# EAGLE design placa (EAGLE 5.01)
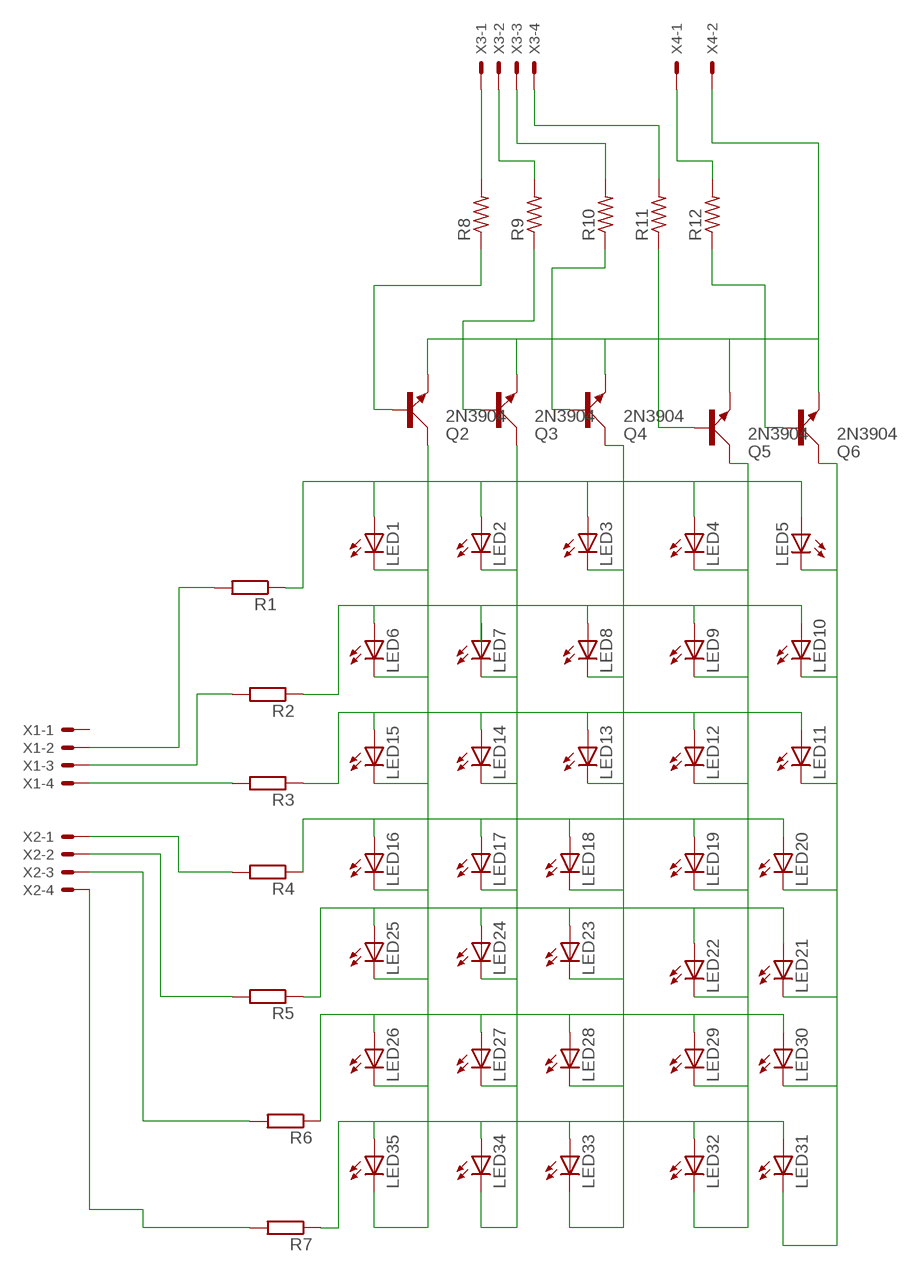
[diagram p0: schematic, sheet 1]

## Parts
LED1  LED5MM  [LED5MM]
LED2  LED5MM  [LED5MM]
LED3  LED5MM  [LED5MM]
LED4  LED5MM  [LED5MM]
LED5  LED5MM  [LED5MM]
LED6  LED5MM  [LED5MM]
LED7  LED5MM  [LED5MM]
LED8  LED5MM  [LED5MM]
LED9  LED5MM  [LED5MM]
LED10  LED5MM  [LED5MM]
LED11  LED5MM  [LED5MM]
LED12  LED5MM  [LED5MM]
LED13  LED5MM  [LED5MM]
LED14  LED5MM  [LED5MM]
LED15  LED5MM  [LED5MM]
LED16  LED5MM  [LED5MM]
LED17  LED5MM  [LED5MM]
LED18  LED5MM  [LED5MM]
LED19  LED5MM  [LED5MM]
LED20  LED5MM  [LED5MM]
LED21  LED5MM  [LED5MM]
LED22  LED5MM  [LED5MM]
LED23  LED5MM  [LED5MM]
LED24  LED5MM  [LED5MM]
LED25  LED5MM  [LED5MM]
LED26  LED5MM  [LED5MM]
LED27  LED5MM  [LED5MM]
LED28  LED5MM  [LED5MM]
LED29  LED5MM  [LED5MM]
LED30  LED5MM  [LED5MM]
LED31  LED5MM  [LED5MM]
LED32  LED5MM  [LED5MM]
LED33  LED5MM  [LED5MM]
LED34  LED5MM  [LED5MM]
LED35  LED5MM  [LED5MM]
Q2  2N3904  [TO92D]
Q3  2N3904  [TO92D]
Q4  2N3904  [TO92D]
Q5  2N3904  [TO92D]
Q6  2N3904  [TO92D]
R1  R-EU_0204/7  [0204/7]
R2  R-EU_0204/7  [0204/7]
R3  R-EU_0204/7  [0204/7]
R4  R-EU_0204/7  [0204/7]
R5  R-EU_0204/7  [0204/7]
R6  R-EU_0204/7  [0204/7]
R7  R-EU_0204/7  [0204/7]
R8  R-US_0204/7  [0204/7]
R9  R-US_0204/7  [0204/7]
R10  R-US_0204/7  [0204/7]
R11  R-US_0204/7  [0204/7]
R12  R-US_0204/7  [0204/7]
X1  KK-156-4  [KK-156-4]
X2  KK-156-4  [KK-156-4]
X3  KK-156-4  [KK-156-4]
X4  KK-156-2  [KK-156-2]

## Nets
N$1: LED1.A LED2.A LED3.A LED4.A LED5.A R1.1
N$2: LED6.A LED8.A LED9.A LED10.A R2.1
N$3: LED11.A LED12.A LED13.A LED14.A LED15.A R3.1
N$4: LED16.A LED17.A LED18.A LED19.A LED20.A R4.1
N$5: LED21.A LED22.A LED23.A LED24.A LED25.A R5.1
N$6: LED26.A LED27.A LED28.A LED29.A LED30.A R6.1
N$7: LED31.A LED32.A LED33.A LED34.A LED35.A R7.1
N$8: LED1.K(C) LED6.K(C) LED15.K(C) LED16.K(C) LED25.K(C) LED26.K(C) LED35.K(C) Q2.C
N$9: LED2.K(C) LED7.K(C) LED14.K(C) LED17.K(C) LED24.K(C) LED27.K(C) LED34.K(C) Q3.C
N$10: LED3.K(C) LED8.K(C) LED13.K(C) LED18.K(C) LED23.K(C) LED28.K(C) LED33.K(C) Q4.C
N$11: LED4.K(C) LED9.K(C) LED12.K(C) LED19.K(C) LED22.K(C) LED29.K(C) LED32.K(C) Q5.C
N$12: LED5.K(C) LED10.K(C) LED11.K(C) LED20.K(C) LED21.K(C) LED30.K(C) LED31.K(C) Q6.C
N$13: R7.2 X2.4
N$14: R6.2 X2.3
N$15: R5.2 X2.2
N$16: R4.2 X2.1
N$17: R3.2 X1.4
N$18: R2.2 X1.3
N$19: R1.2 X1.2
N$20: R8.2 X3.1
N$21: R9.2 X3.2
N$22: R10.2 X3.3
N$23: R11.2 X3.4
N$24: R12.2 X4.1
N$25: Q2.B R8.1
N$26: Q3.B R9.1
N$27: Q4.B R10.1
N$28: Q5.B R11.1
N$29: Q6.B R12.1
N$30: Q2.E Q3.E Q4.E Q5.E Q6.E X4.2
Unconnected: LED7.A X1.1

## Library data of the parts
LED1-LED35 = led:LED: LED OSRAM: - CHIPLED LG R971, LG N971, LY N971, LG Q971, LY Q971, LO R971, LY R971 LH N974, LH R974 LS Q976, LO Q976, LY Q976 LO Q996 - Hyper CHIPLED LW Q18S LB Q993, LB Q99A, LB R99A - SideLED LS A670, LO A670, LY A670, LG A670, LP A670 LB A673, LV A673, LT A673, LW A673 LH A674 LY A675 LS A676, LA A676, LO A676, LY A676, LW A676 LS A679, LY A679, LG A679 - Hyper Micro SIDELED® LS Y876, LA Y876, LO Y876, LY Y876 LT Y87S - SmartLED LW L88C, LW L88S LB L89C, LB L89S, LG L890 LS L89K, LO L89K, LY L89K LS L896, LA L896, LO L896, LY L896 - TOPLED LS T670, LO T670, LY T670, LG T670, LP T670 LSG T670, LSP T670, LSY T670, LOP T670, LYG T670 LG T671, LOG T671, LSG T671 LB T673, LV T673, LT T673, LW T673 LH T674 LS T676, LA T676, LO T676, LY T676, LB T676, LH T676, LSB T676, LW T676 LB T67C, LV T67C, LT T67C, LS T67K, LO T67K, LY T67K, LW E67C LS E67B, LA E67B, LO E67B, LY E67B, LB E67C, LV E67C, LT E67C LW T67C LS T679, LY T679, LG T679 LS T770, LO T770, LY T770, LG T770, LP T770 LB T773, LV T773, LT T773, LW T773 LH T774 LS E675, LA E675, LY E675, LS T675 LS T776, LA T776, LO T776, LY T776, LB T776 LHGB T686 LT T68C, LB T68C - Hyper Mini TOPLED® LB M676 - Mini TOPLED Santana® LG M470 LS M47K, LO M47K, LY M47K Source: http://www.osram.convergy.de - LUMILED® LXK2-PW12-R00, LXK2-PW12-S00, LXK2-PW14-U00, LXK2-PW14-V00 LXK2-PM12-R00, LXK2-PM12-S00, LXK2-PM14-U00 LXK2-PE12-Q00, LXK2-PE12-R00, LXK2-PE12-S00, LXK2-PE14-T00, LXK2-PE14-U00 LXK2-PB12-K00, LXK2-PB12-L00, LXK2-PB12-M00, LXK2-PB14-N00, LXK2-PB14-P00, LXK2-PB14-Q00 LXK2-PR12-L00, LXK2-PR12-M00, LXK2-PR14-Q00, LXK2-PR14-R00 LXK2-PD12-Q00, LXK2-PD12-R00, LXK2-PD12-S00 LXK2-PH12-R00, LXK2-PH12-S00 LXK2-PL12-P00, LXK2-PL12-Q00, LXK2-PL12-R00 Source: www.luxeon.com
Q2-Q6 = transistor-small-signal:2N3904: NPN TRANSISTOR
R1-R7 = resistor:R-EU_: RESISTOR, European symbol
R8-R12 = resistor:R-US_: RESISTOR, American symbol
X1-X3 = con-molex:KK-156-4: KK 156 HEADER Source: http://www.molex.com/pdm_docs/sd/026604100_sd.pdf
X4 = con-molex:KK-156-2: KK 156 HEADER Source: http://www.molex.com/pdm_docs/sd/026604100_sd.pdf

## Board
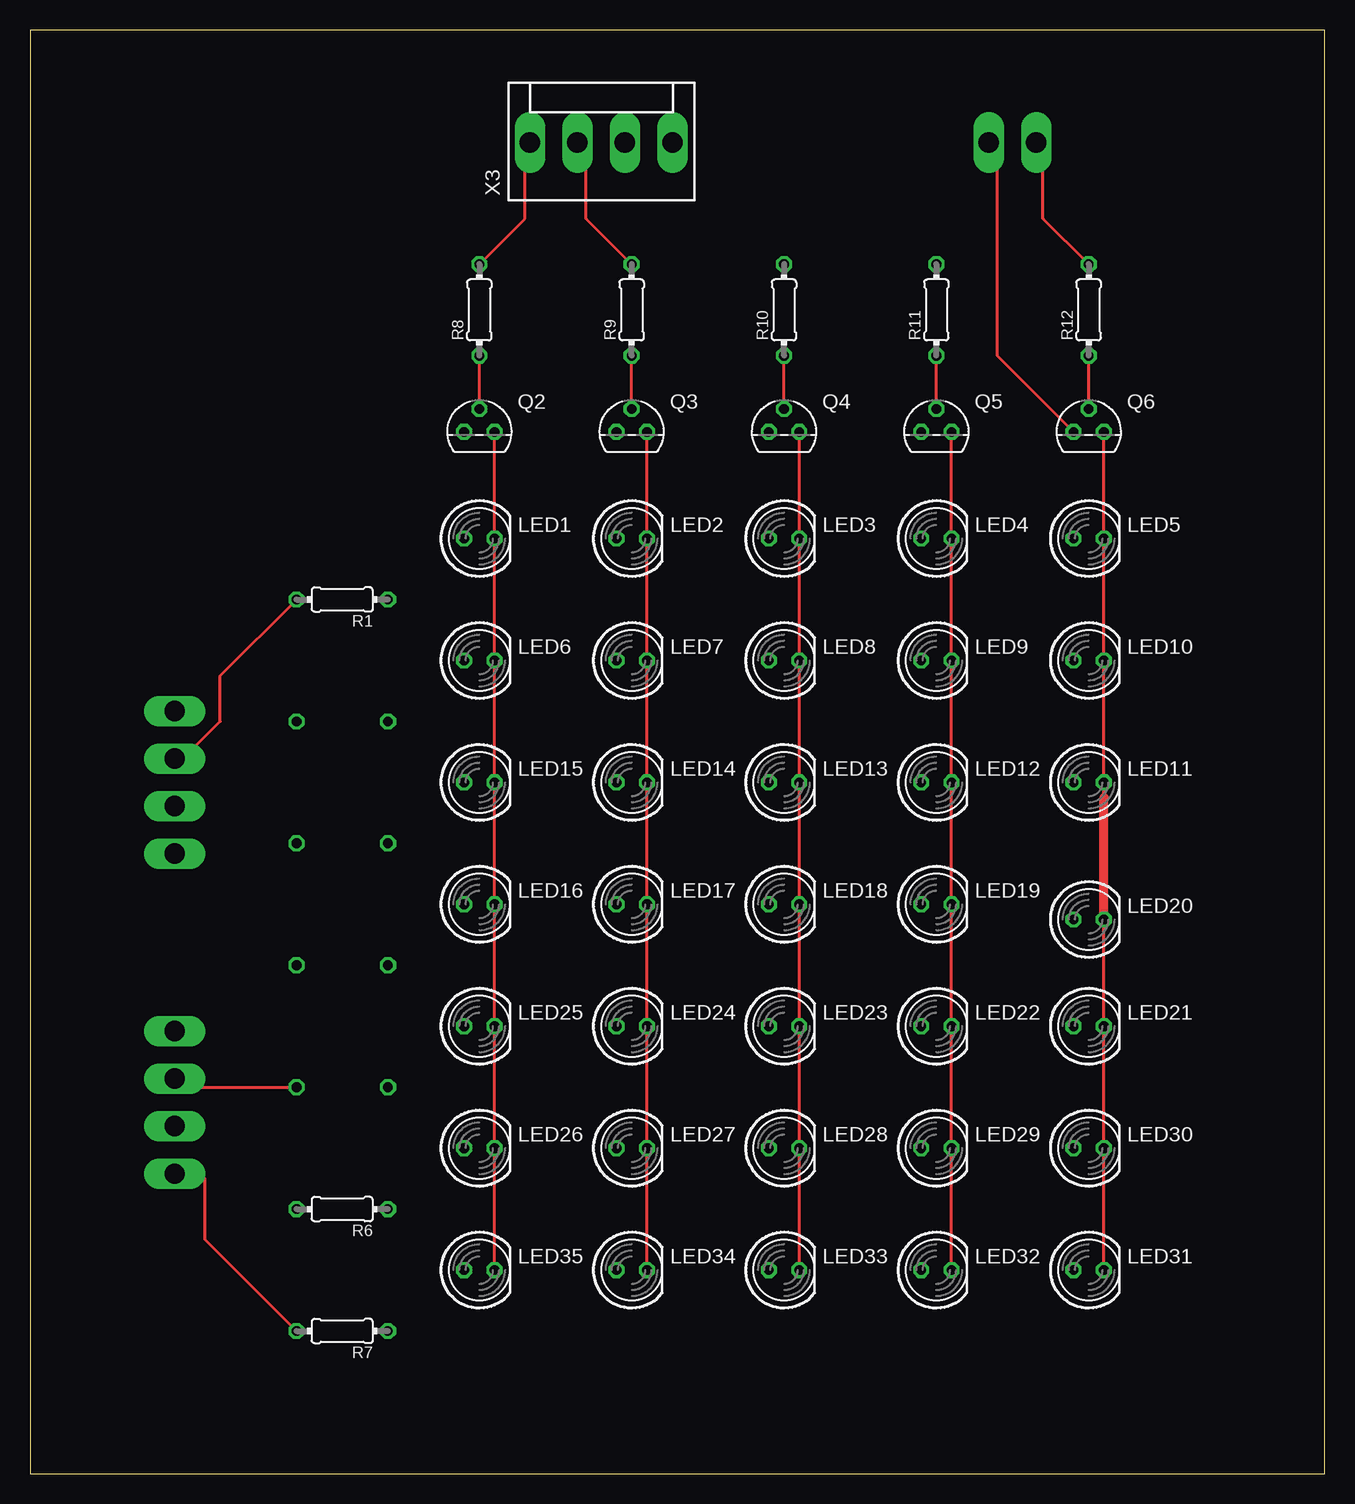
[diagram p1: board, top side]
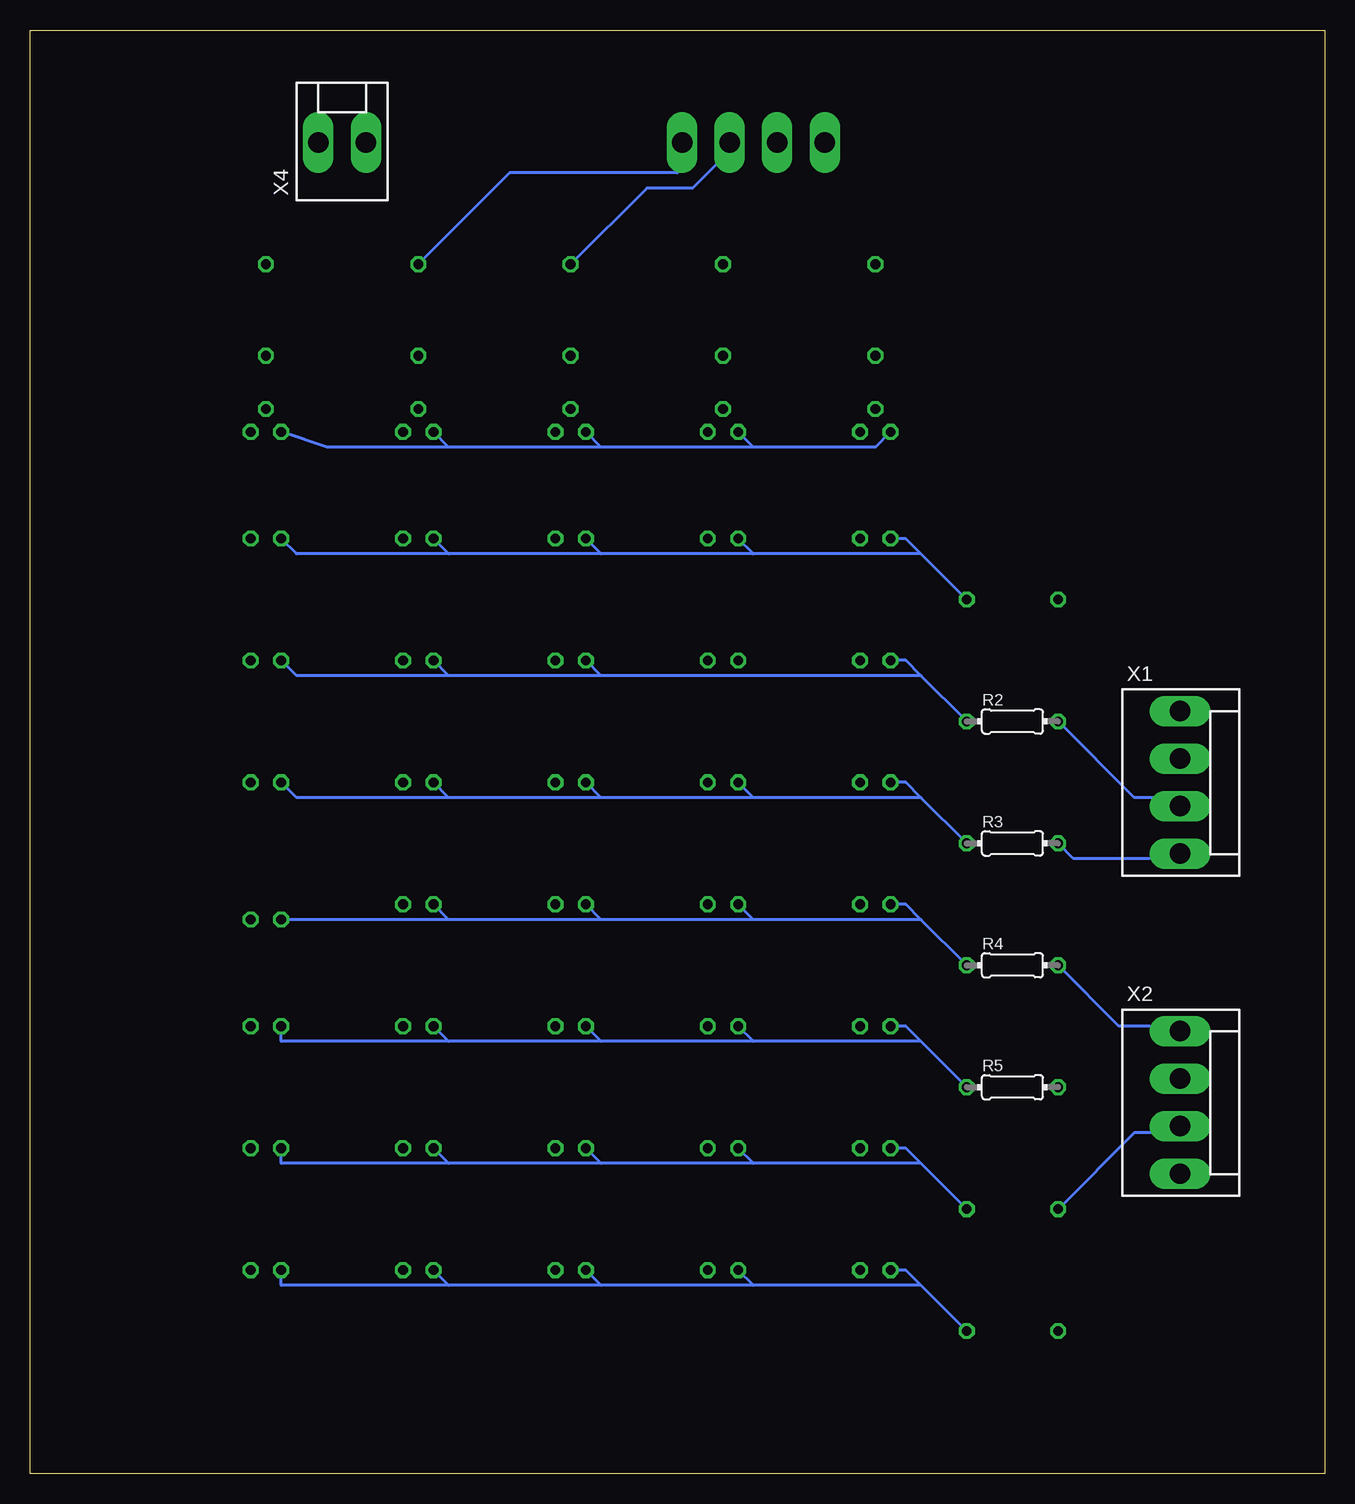
[diagram p2: board, bottom side, seen from below]

Size 107.93 x 120.32 mm. Coordinates in mm from the lower left corner, seen from the top.
Outline: 0,0 107.93,0 107.93,120.32 0,120.32 0,0
Copper layers (1*16): Top 0.035mm / dielectric 1.5mm / Bottom 0.035mm
Design rules "default *": minimum track width 30mil, minimum drill 24mil, track to track 8mil, track to pad 8mil, pad to pad 8mil, via to via 8mil, smd to smd 8mil, copper to edge 40mil, drill to drill 8mil, minimum pad ring 10mil, minimum via ring 8mil, stop-mask expansion 4mil, vias tented up to drill 0mil, thermal gap 10mil

### Footprints (pad centres in the part's own frame; a part is rotated, then mirrored left to right if it is on the bottom)
LED5MM = drill 0.813 octagon: A -1.27,0; K 1.27,0
TO92D = drill 0.813 octagon: B 0,1.905; C 1.27,0; E -1.27,0
0204/7 = drill 0.813 octagon: 1 -3.81,0; 2 3.81,0
KK-156-4 = drill 1.7 pad 2.184 long: 1 -5.94,0; 2 -1.98,0; 3 1.98,0; 4 5.94,0
KK-156-2 = drill 1.7 pad 2.184 long: 1 -1.98,0; 2 1.98,0

### Placement (x,y rotation side)
LED1  37.46,77.94 0 top
LED2  50.16,77.94 0 top
LED3  62.86,77.94 0 top
LED4  75.56,77.94 0 top
LED5  88.26,77.94 0 top
LED6  37.46,67.78 0 top
LED7  50.16,67.78 0 top
LED8  62.86,67.78 0 top
LED9  75.56,67.78 0 top
LED10  88.26,67.78 0 top
LED11  88.26,57.62 0 top
LED12  75.56,57.62 0 top
LED13  62.86,57.62 0 top
LED14  50.16,57.62 0 top
LED15  37.46,57.62 0 top
LED16  37.46,47.46 0 top
LED17  50.16,47.46 0 top
LED18  62.86,47.46 0 top
LED19  75.56,47.46 0 top
LED20  88.26,46.19 0 top
LED21  88.26,37.3 0 top
LED22  75.56,37.3 0 top
LED23  62.86,37.3 0 top
LED24  50.16,37.3 0 top
LED25  37.46,37.3 0 top
LED26  37.46,27.14 0 top
LED27  50.16,27.14 0 top
LED28  62.86,27.14 0 top
LED29  75.56,27.14 0 top
LED30  88.26,27.14 0 top
LED31  88.26,16.98 0 top
LED32  75.56,16.98 0 top
LED33  62.86,16.98 0 top
LED34  50.16,16.98 0 top
LED35  37.46,16.98 0 top
Q2  37.46,86.83 0 top
Q3  50.16,86.83 0 top
Q4  62.86,86.83 0 top
Q5  75.56,86.83 0 top
Q6  88.26,86.83 0 top
R1  26.03,72.86 180 top
R2  26.03,62.7 0 bottom
R3  26.03,52.54 0 bottom
R4  26.03,42.38 0 bottom
R5  26.03,32.22 0 bottom
R6  26.03,22.06 180 top
R7  26.03,11.9 180 top
R8  37.46,96.99 90 top
R9  50.16,96.99 90 top
R10  62.86,96.99 90 top
R11  75.56,96.99 90 top
R12  88.26,96.99 90 top
X1  12.06,57.62 270 bottom
X2  12.06,30.95 270 bottom
X3  47.62,110.96 0 top
X4  81.91,110.96 0 bottom

### Tracks (layer width: path | path; a pad name or v marks a point on that pad's centre or on a via)
N$1
  Bottom 0.254: 33.65,76.67 34.92,77.94 LED1.A | R1.1 33.65,76.67 | 47.62,76.67 LED2.A | 33.65,76.67 47.62,76.67 | 60.32,76.67 LED3.A | 47.62,76.67 60.32,76.67 | 73.02,76.67 LED4.A | 60.32,76.67 73.02,76.67 | LED5.A 85.72,76.67 73.02,76.67
N$2
  Bottom 0.254: 33.65,66.51 34.92,67.78 LED6.A | R2.1 33.65,66.51 | 60.32,66.51 LED8.A | 33.65,66.51 60.32,66.51 | 73.02,66.51 LED9.A | 60.32,66.51 73.02,66.51 | LED10.A 85.72,66.51 73.02,66.51
N$3
  Bottom 0.254: 33.65,56.35 34.92,57.62 LED15.A | R3.1 33.65,56.35 | 47.62,56.35 LED14.A | 33.65,56.35 47.62,56.35 | 60.32,56.35 LED13.A | 47.62,56.35 60.32,56.35 | 73.02,56.35 LED12.A | 60.32,56.35 73.02,56.35 | LED11.A 85.72,56.35 73.02,56.35
N$4
  Bottom 0.254: 33.65,46.19 34.92,47.46 LED16.A | R4.1 33.65,46.19 | 47.62,46.19 LED17.A | 33.65,46.19 47.62,46.19 | 60.32,46.19 LED18.A | 47.62,46.19 60.32,46.19 | 73.02,46.19 LED19.A | 60.32,46.19 73.02,46.19 | 73.02,46.19 LED20.A
N$5
  Bottom 0.254: 33.65,36.03 34.92,37.3 LED25.A | R5.1 33.65,36.03 | 47.62,36.03 LED24.A | 33.65,36.03 47.62,36.03 | 60.32,36.03 LED23.A | 47.62,36.03 60.32,36.03 | 73.02,36.03 LED22.A | 60.32,36.03 73.02,36.03 | LED21.A 86.99,36.03 73.02,36.03
N$6
  Bottom 0.254: 33.65,25.87 34.92,27.14 LED26.A | R6.1 33.65,25.87 | 47.62,25.87 LED27.A | 33.65,25.87 47.62,25.87 | 60.32,25.87 LED28.A | 47.62,25.87 60.32,25.87 | 73.02,25.87 LED29.A | 60.32,25.87 73.02,25.87 | LED30.A 86.99,25.87 73.02,25.87
N$7
  Bottom 0.254: 33.65,15.71 34.92,16.98 LED35.A | R7.1 33.65,15.71 | 47.62,15.71 LED34.A | 33.65,15.71 47.62,15.71 | 60.32,15.71 LED33.A | 47.62,15.71 60.32,15.71 | 73.02,15.71 LED32.A | 60.32,15.71 73.02,15.71 | LED31.A 86.99,15.71 73.02,15.71
N$8
  Top 0.254: Q2.C LED1.K LED6.K LED15.K LED16.K LED25.K LED26.K LED35.K
N$9
  Top 0.254: Q3.C LED2.K LED7.K LED14.K LED17.K LED24.K LED27.K LED34.K
N$10
  Top 0.254: Q4.C LED3.K LED8.K LED13.K LED18.K LED23.K LED28.K LED33.K
N$11
  Top 0.254: Q5.C LED4.K LED9.K LED12.K LED19.K LED22.K LED29.K LED32.K
N$12
  Top 0.254: Q6.C LED5.K LED10.K LED11.K 89.53,56.35 | LED31.K LED30.K LED21.K LED20.K
  Top 0.762: LED20.K 89.53,56.35
N$13
  Top 0.254: R7.2 14.6,19.52 14.6,24.6 X2.4
N$14
  Bottom 0.254: R6.2 15.87,28.41 13.33,28.41 X2.3
N$15
  Top 0.254: R5.2 13.33,32.22 X2.2
N$16
  Bottom 0.254: R4.2 17.14,37.3 14.6,37.3 X2.1
N$17
  Bottom 0.254: R3.2 20.95,51.27 14.6,51.27 X1.4
N$18
  Bottom 0.254: R2.2 15.87,56.35 13.33,56.35 X1.3
N$19
  Top 0.254: R1.2 15.87,66.51 15.87,62.7 13.33,60.16 X1.2
N$20
  Top 0.254: R8.2 41.27,104.61 41.27,108.42 X3.1
N$21
  Top 0.254: R9.2 46.35,104.61 46.35,109.69 X3.2
N$22
  Bottom 0.254: R10.2 56.51,107.15 52.7,107.15 50.16,109.69 X3.3
N$23
  Bottom 0.254: R11.2 67.94,108.42 53.97,108.42 X3.4
N$24
  Top 0.254: R12.2 84.45,104.61 84.45,109.69 X4.1
N$25
  Top 0.254: Q2.B R8.1
N$26
  Top 0.254: Q3.B R9.1
N$27
  Top 0.254: Q4.B R10.1
N$28
  Top 0.254: Q5.B R11.1
N$29
  Top 0.254: Q6.B R12.1
N$30
  Top 0.254: Q6.E 80.64,93.18 80.64,109.69 X4.2
  Bottom 0.254: Q2.E 37.46,85.56 47.62,85.56 | 47.62,85.56 Q3.E | 60.32,85.56 Q4.E | 47.62,85.56 60.32,85.56 | 73.02,85.56 Q5.E | 60.32,85.56 73.02,85.56 | X4.2 80.64,109.69 | Q6.E 83.18,85.56 73.02,85.56